# Altium schematic sheet TermWylPomp1_rf.SchDoc
size A4; LotOfPieces: 1
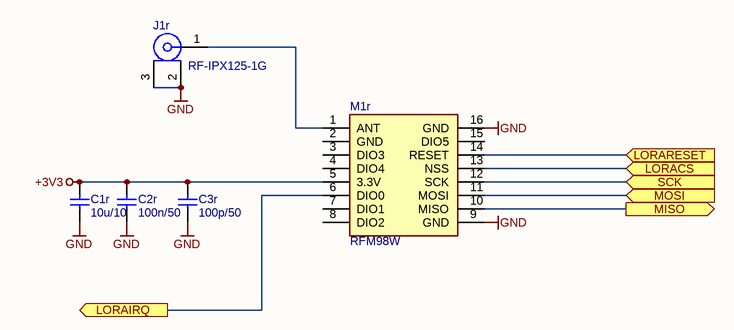
[diagram p0: TermWylPomp1_rf.SchDoc]

## Parts
C1r  10u/10  [0805]
C2r  100n/50  [0603-IPC]
C3r  100p/50  [0603-IPC]
J1r  RF-IPX125-1G  [HIROSE-UFL]
M1r  RFM98W  [RFM98W]

## Ports
LORACS (in), LORAIRQ (out), LORARESET (in), MISO (out), MOSI (in), SCK (in)

## Nets
+3V3: C1r.1 C2r.1 C3r.1 M1r.5(3.3V)
GND: C1r.2 C2r.2 C3r.2 J1r.2 J1r.3 M1r.9(GND) M1r.16(GND)
LORACS: M1r.13(NSS) ; port LORACS
LORAIRQ: M1r.6(DIO0) ; port LORAIRQ
LORARESET: M1r.14(RESET) ; port LORARESET
MISO: M1r.10(MISO) ; port MISO
MOSI: M1r.11(MOSI) ; port MOSI
SCK: M1r.12(SCK) ; port SCK
NetJ1r_1: J1r.1 M1r.1(ANT)

Not connected (* = marked no-connect by the designer): M1r 2(GND) 3(DIO3) 4(DIO4) 7(DIO1) 8(DIO2) 15(DIO5)

## Notes on the sheet
- Wariant:
- Rev.
- /
- Projekt i wykonanie: (C) Miroslaw Lach MRQ, www.mlach.com
- git:
- Page:
- Plik:

## Library data of the parts
C1r = CAP25: Descript: Kondensator: ceramiczny; MLCC; 10uF; 10V; X7R; ±10%; SMD; 0805; Reference5: CL21B106KPQNNNG; Kod: CAP25; ID: 25; Value: 10u/10; Supplier5: tme.pl; Manufacturer5: Samsung; Typ5: CL21B106KPQNNNG; Price5: 0; DateOfPrice5: 2010-01-01
C2r = CAP6: Descript: Kondensator: ceramiczny; MLCC; 100nF; 50V; X7R; ±5%; SMD; 0603; Reference5: CL10B104JB8NNNC; Kod: CAP6; ID: 6; Value: 100n/50; Supplier5: tme.pl; Manufacturer5: Samsung; Typ5: CL10B104JB8NNNC; Price5: 0,25; DateOfPrice5: 2020-05-10
C3r = CAP10: Descript: capacitor 100pF,50V, 0603, COG, 5%; Reference5: CL10C101JB8NNNC; Kod: CAP10; ID: 10; Value: 100p/50; Supplier5: tme.pl; Manufacturer5: Samsung; Typ5: CL10C101JB8NNNC; Price5: 0; DateOfPrice5: 2010-01-01
J1r = Con210: Descript: Miniaturowe 1G, męskie gniazdo RF, antenowe, o wysokość 1.25mm, 1 generacji, obudowa srebrzona, kontakt złocony, 0-6 GHz, do montażu SMT; Reference5: RF-IPX125-1G-AG; Kod: Con210; ID: 210; Replacement: bd; Value: RF-IPX125-1G; Supplier5: maritex.com.pl; Price5: 1; DateOfPrice5: 2010-01-01; Manufacturer5: Hirose
M1r = Mod57: Descript: Moduł: RF; transceiver FM; FSK, GFSK, GMSK, LoRa, MSK, OOK; 433,92MHz; Reference5: RFM98W-433S2; Kod: Mod57; ID: 57; Value: RFM98W; Supplier5: tme.pl; Typ5: RFM98W-433S2; Price5: 39; DateOfPrice5: 2010-01-01; Manufacturer5: Hope